# Altium project AirConditioner.PrjPcb
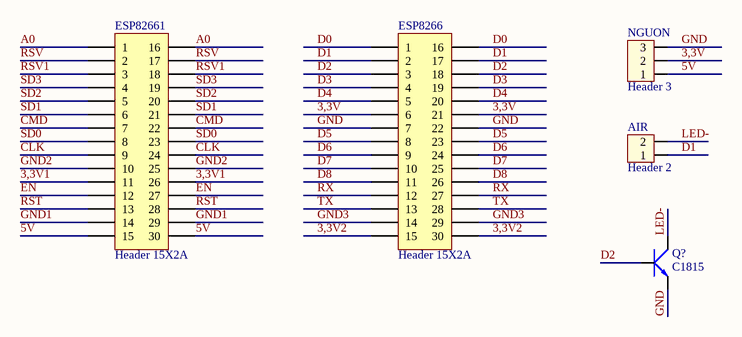
[diagram p0: Air.SchDoc]
1 sheet, 5 parts. Net scope: global (net labels, ports and power ports of the same name join across sheets).
Board file: AIR.PcbDoc

## Sheet Air.SchDoc
size A4

### Parts
AIR  Header 2  [HED2]
ESP8266  Header 15X2A  [HDR2X15_CEN]
ESP82661  Header 15X2A  [HDR2X15_CEN]
NGUON  Header 3  [HED3T]
Q?  C1815  [QTO-92]

### Nets
3,3V: ESP8266.6 ESP8266.21 NGUON.2
3,3V1: ESP82661.11 ESP82661.26
3,3V2: ESP8266.15 ESP8266.30
5V: ESP82661.15 ESP82661.30 NGUON.1
A0: ESP82661.1 ESP82661.16
CLK: ESP82661.9 ESP82661.24
CMD: ESP82661.7 ESP82661.22
D0: ESP8266.1 ESP8266.16
D1: AIR.1 ESP8266.2 ESP8266.17
D2: ESP8266.3 ESP8266.18 Q?.3(B)
D3: ESP8266.4 ESP8266.19
D4: ESP8266.5 ESP8266.20
D5: ESP8266.8 ESP8266.23
D6: ESP8266.9 ESP8266.24
D7: ESP8266.10 ESP8266.25
D8: ESP8266.11 ESP8266.26
EN: ESP82661.12 ESP82661.27
GND: ESP8266.7 ESP8266.22 NGUON.3 Q?.1(E)
GND1: ESP82661.14 ESP82661.29
GND2: ESP82661.10 ESP82661.25
GND3: ESP8266.14 ESP8266.29
LED-: AIR.2 Q?.2(C)
RST: ESP82661.13 ESP82661.28
RSV: ESP82661.2 ESP82661.17
RSV1: ESP82661.3 ESP82661.18
RX: ESP8266.12 ESP8266.27
SD0: ESP82661.8 ESP82661.23
SD1: ESP82661.6 ESP82661.21
SD2: ESP82661.5 ESP82661.20
SD3: ESP82661.4 ESP82661.19
TX: ESP8266.13 ESP8266.28

### Library data of the parts
AIR = Header 2: Header 2 (Green); Value: Header 2
ESP8266 ESP82661 = Header 15X2A: Header, 15-Pin, Dual row; LatestRevisionDate: 17-Jul-2002; LatestRevisionNote: Re-released for DXP Platform.; Publisher: Altium Limited
NGUON = Hed3: Header 3 (Green); Value: Header 3
Q? = C1815: NPN 600mW, ECB; Value: C1815